# EAGLE design bac-bmb (EAGLE 6.6.0)
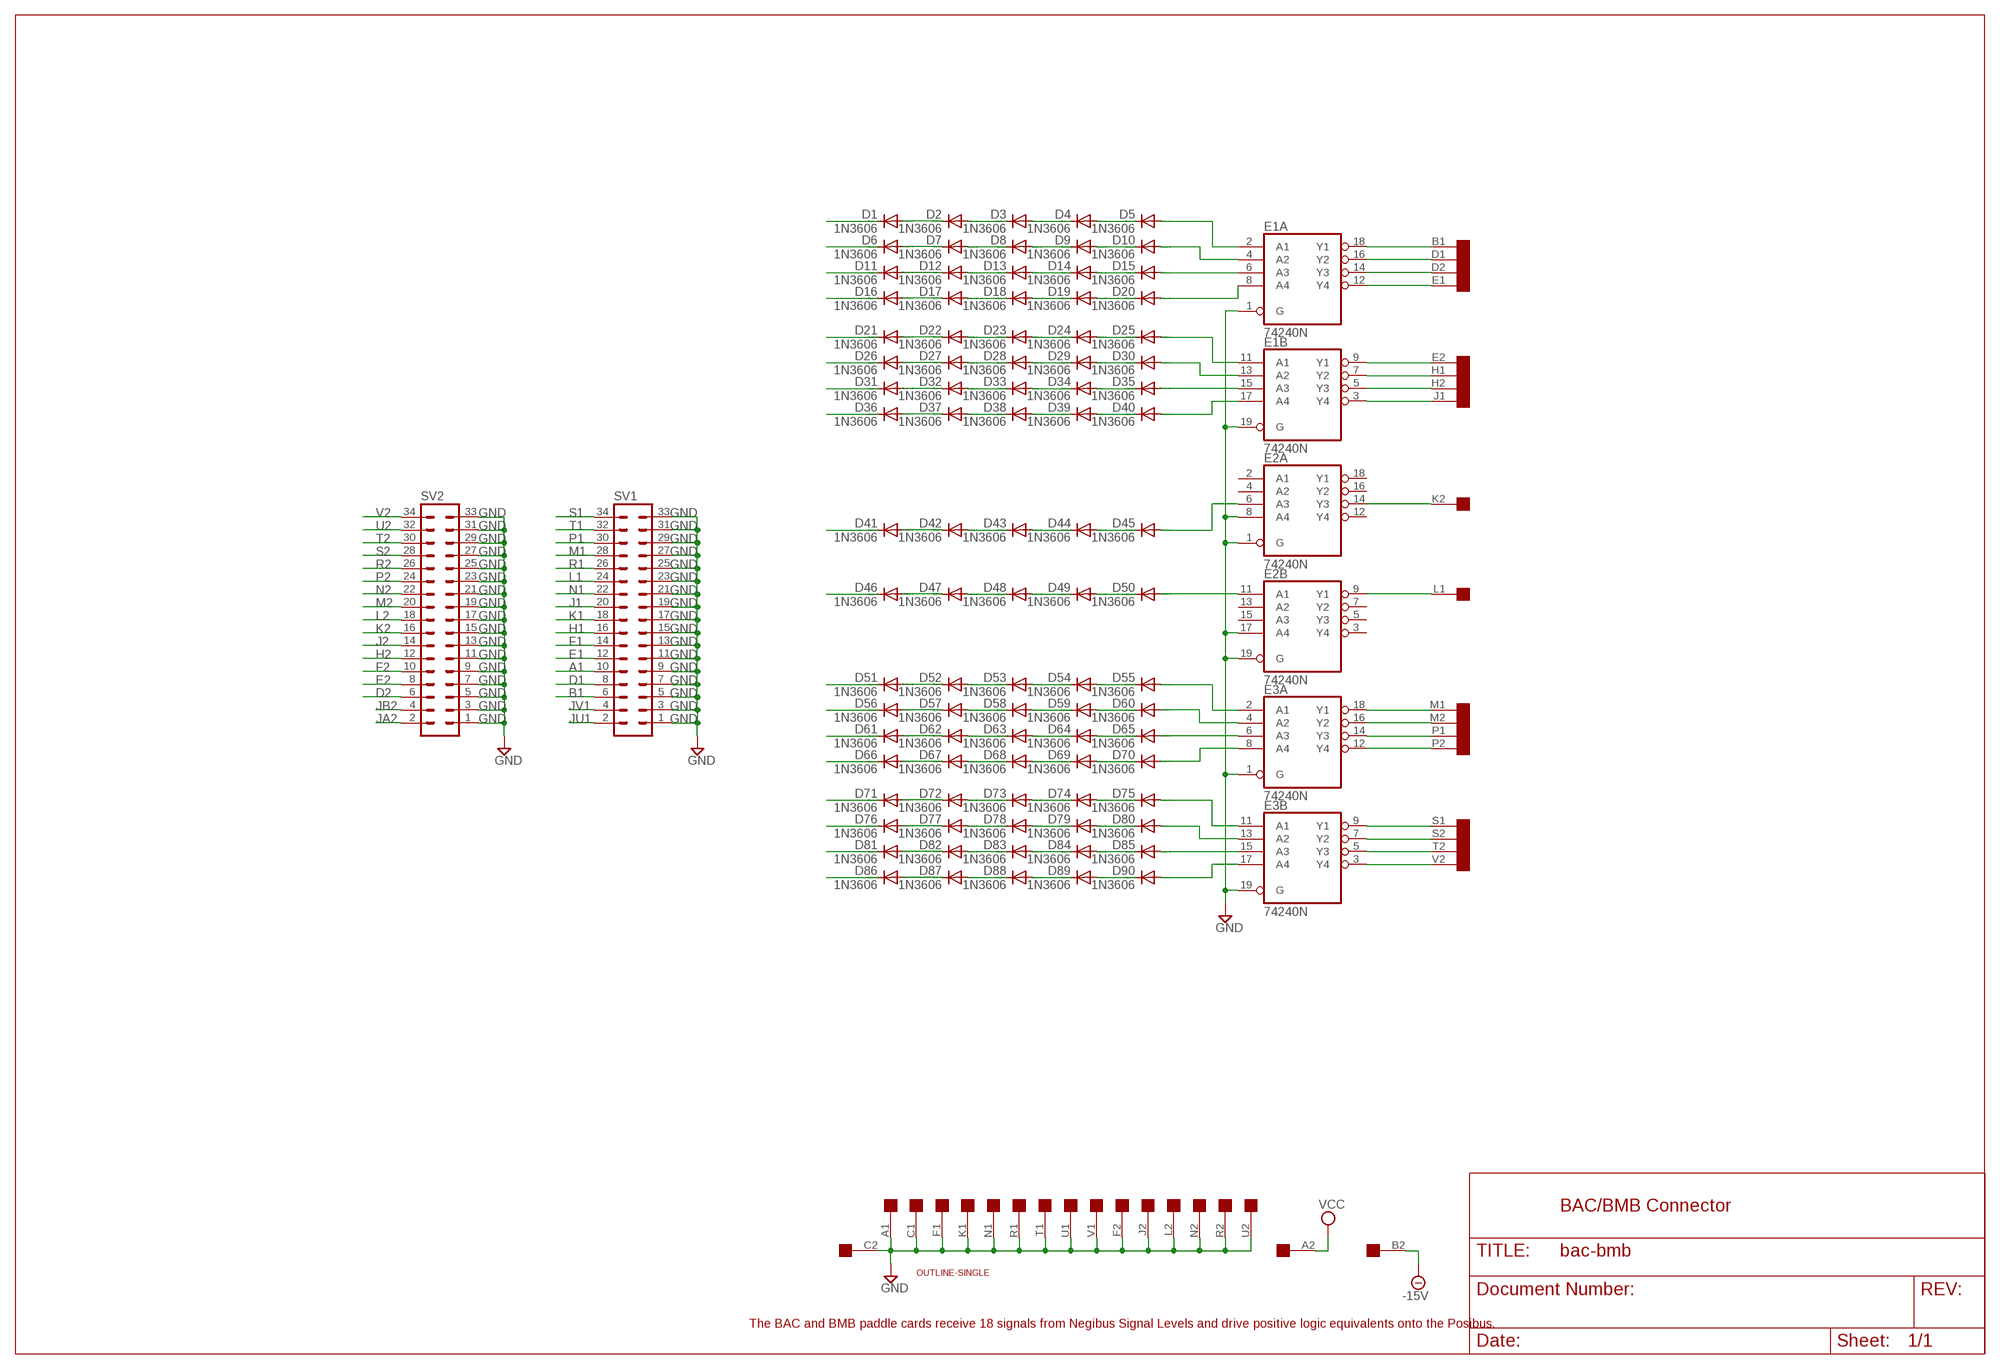
[diagram p0: schematic, sheet 1]

## Parts
D1  1N3606  DIODE-DO35-10  [DO35-10]
D2  1N3606  DIODE-DO35-10  [DO35-10]
D3  1N3606  DIODE-DO35-10  [DO35-10]
D4  1N3606  DIODE-DO35-10  [DO35-10]
D5  1N3606  DIODE-DO35-10  [DO35-10]
D6  1N3606  DIODE-DO35-10  [DO35-10]
D7  1N3606  DIODE-DO35-10  [DO35-10]
D8  1N3606  DIODE-DO35-10  [DO35-10]
D9  1N3606  DIODE-DO35-10  [DO35-10]
D10  1N3606  DIODE-DO35-10  [DO35-10]
D11  1N3606  DIODE-DO35-10  [DO35-10]
D12  1N3606  DIODE-DO35-10  [DO35-10]
D13  1N3606  DIODE-DO35-10  [DO35-10]
D14  1N3606  DIODE-DO35-10  [DO35-10]
D15  1N3606  DIODE-DO35-10  [DO35-10]
D16  1N3606  DIODE-DO35-10  [DO35-10]
D17  1N3606  DIODE-DO35-10  [DO35-10]
D18  1N3606  DIODE-DO35-10  [DO35-10]
D19  1N3606  DIODE-DO35-10  [DO35-10]
D20  1N3606  DIODE-DO35-10  [DO35-10]
D21  1N3606  DIODE-DO35-10  [DO35-10]
D22  1N3606  DIODE-DO35-10  [DO35-10]
D23  1N3606  DIODE-DO35-10  [DO35-10]
D24  1N3606  DIODE-DO35-10  [DO35-10]
D25  1N3606  DIODE-DO35-10  [DO35-10]
D26  1N3606  DIODE-DO35-10  [DO35-10]
D27  1N3606  DIODE-DO35-10  [DO35-10]
D28  1N3606  DIODE-DO35-10  [DO35-10]
D29  1N3606  DIODE-DO35-10  [DO35-10]
D30  1N3606  DIODE-DO35-10  [DO35-10]
D31  1N3606  DIODE-DO35-10  [DO35-10]
D32  1N3606  DIODE-DO35-10  [DO35-10]
D33  1N3606  DIODE-DO35-10  [DO35-10]
D34  1N3606  DIODE-DO35-10  [DO35-10]
D35  1N3606  DIODE-DO35-10  [DO35-10]
D36  1N3606  DIODE-DO35-10  [DO35-10]
D37  1N3606  DIODE-DO35-10  [DO35-10]
D38  1N3606  DIODE-DO35-10  [DO35-10]
D39  1N3606  DIODE-DO35-10  [DO35-10]
D40  1N3606  DIODE-DO35-10  [DO35-10]
D41  1N3606  DIODE-DO35-10  [DO35-10]
D42  1N3606  DIODE-DO35-10  [DO35-10]
D43  1N3606  DIODE-DO35-10  [DO35-10]
D44  1N3606  DIODE-DO35-10  [DO35-10]
D45  1N3606  DIODE-DO35-10  [DO35-10]
D46  1N3606  DIODE-DO35-10  [DO35-10]
D47  1N3606  DIODE-DO35-10  [DO35-10]
D48  1N3606  DIODE-DO35-10  [DO35-10]
D49  1N3606  DIODE-DO35-10  [DO35-10]
D50  1N3606  DIODE-DO35-10  [DO35-10]
D51  1N3606  DIODE-DO35-10  [DO35-10]
D52  1N3606  DIODE-DO35-10  [DO35-10]
D53  1N3606  DIODE-DO35-10  [DO35-10]
D54  1N3606  DIODE-DO35-10  [DO35-10]
D55  1N3606  DIODE-DO35-10  [DO35-10]
D56  1N3606  DIODE-DO35-10  [DO35-10]
D57  1N3606  DIODE-DO35-10  [DO35-10]
D58  1N3606  DIODE-DO35-10  [DO35-10]
D59  1N3606  DIODE-DO35-10  [DO35-10]
D60  1N3606  DIODE-DO35-10  [DO35-10]
D61  1N3606  DIODE-DO35-10  [DO35-10]
D62  1N3606  DIODE-DO35-10  [DO35-10]
D63  1N3606  DIODE-DO35-10  [DO35-10]
D64  1N3606  DIODE-DO35-10  [DO35-10]
D65  1N3606  DIODE-DO35-10  [DO35-10]
D66  1N3606  DIODE-DO35-10  [DO35-10]
D67  1N3606  DIODE-DO35-10  [DO35-10]
D68  1N3606  DIODE-DO35-10  [DO35-10]
D69  1N3606  DIODE-DO35-10  [DO35-10]
D70  1N3606  DIODE-DO35-10  [DO35-10]
D71  1N3606  DIODE-DO35-10  [DO35-10]
D72  1N3606  DIODE-DO35-10  [DO35-10]
D73  1N3606  DIODE-DO35-10  [DO35-10]
D74  1N3606  DIODE-DO35-10  [DO35-10]
D75  1N3606  DIODE-DO35-10  [DO35-10]
D76  1N3606  DIODE-DO35-10  [DO35-10]
D77  1N3606  DIODE-DO35-10  [DO35-10]
D78  1N3606  DIODE-DO35-10  [DO35-10]
D79  1N3606  DIODE-DO35-10  [DO35-10]
D80  1N3606  DIODE-DO35-10  [DO35-10]
D81  1N3606  DIODE-DO35-10  [DO35-10]
D82  1N3606  DIODE-DO35-10  [DO35-10]
D83  1N3606  DIODE-DO35-10  [DO35-10]
D84  1N3606  DIODE-DO35-10  [DO35-10]
D85  1N3606  DIODE-DO35-10  [DO35-10]
D86  1N3606  DIODE-DO35-10  [DO35-10]
D87  1N3606  DIODE-DO35-10  [DO35-10]
D88  1N3606  DIODE-DO35-10  [DO35-10]
D89  1N3606  DIODE-DO35-10  [DO35-10]
D90  1N3606  DIODE-DO35-10  [DO35-10]
E1  74240N  74LS240N  [DIL20]
E2  74240N  74LS240N  [DIL20]
E3  74240N  74LS240N  [DIL20]
SV1  MA17-2  [MA17-2]
SV2  MA17-2  [MA17-2]
U$1  SINGLE  [EDGE-CON2]
U$2  OUTLINE-SINGLE  [SINGLE]

## Nets
-15V: U$1.B2
A1: SV1.10
B1: D1.C SV1.6
D1: D6.C SV1.8
D2: D11.C SV2.6
E1: D16.C SV1.12
E2: D21.C SV2.8
F1: SV1.14
F2: SV2.10
GND [power]: E1.1(A:G) E1.19(B:G) E2.1(A:G) E2.8(A:A4) E2.17(B:A4) E2.19(B:G) E3.1(A:G) E3.19(B:G) SV1.1 SV1.3 SV1.5 SV1.7 SV1.9 SV1.11 SV1.13 SV1.15 SV1.17 SV1.19 SV1.21 SV1.23 SV1.25 SV1.27 SV1.29 SV1.31 SV1.33 SV2.1 SV2.3 SV2.5 SV2.7 SV2.9 SV2.11 SV2.13 SV2.15 SV2.17 SV2.19 SV2.21 SV2.23 SV2.25 SV2.27 SV2.29 SV2.31 SV2.33 U$1.A1 U$1.C1 U$1.C2 U$1.F1 U$1.F2 U$1.J2 U$1.K1 U$1.L2 U$1.N1 U$1.N2 U$1.R1 U$1.R2 U$1.T1 U$1.U1 U$1.U2 U$1.V1
H1: D26.C SV1.16
H2: D31.C SV2.12
J1: D36.C SV1.20
J2: SV2.14
JA2: SV2.2
JB2: SV2.4
JU1: SV1.2
JV1: SV1.4
K1: SV1.18
K2: D41.C SV2.16
L1: D46.C SV1.24
L2: SV2.18
M1: D51.C SV1.28
M2: D56.C SV2.20
N1: SV1.22
N2: SV2.22
N$1: D1.A D2.C
N$2: D2.A D3.C
N$3: D3.A D4.C
N$4: D4.A D5.C
N$5: D6.A D7.C
N$6: D7.A D8.C
N$7: D8.A D9.C
N$8: D9.A D10.C
N$9: D11.A D12.C
N$10: D12.A D13.C
N$11: D13.A D14.C
N$12: D14.A D15.C
N$13: D16.A D17.C
N$14: D17.A D18.C
N$15: D18.A D19.C
N$16: D19.A D20.C
N$17: D21.A D22.C
N$18: D22.A D23.C
N$19: D23.A D24.C
N$20: D24.A D25.C
N$21: D26.A D27.C
N$22: D27.A D28.C
N$23: D28.A D29.C
N$24: D29.A D30.C
N$25: D31.A D32.C
N$26: D32.A D33.C
N$27: D33.A D34.C
N$28: D34.A D35.C
N$29: D36.A D37.C
N$30: D37.A D38.C
N$31: D38.A D39.C
N$32: D39.A D40.C
N$33: D41.A D42.C
N$34: D42.A D43.C
N$35: D43.A D44.C
N$36: D44.A D45.C
N$37: D46.A D47.C
N$38: D47.A D48.C
N$39: D48.A D49.C
N$40: D49.A D50.C
N$41: D51.A D52.C
N$42: D52.A D53.C
N$43: D53.A D54.C
N$44: D54.A D55.C
N$45: D56.A D57.C
N$46: D57.A D58.C
N$47: D58.A D59.C
N$48: D59.A D60.C
N$49: D61.A D62.C
N$50: D62.A D63.C
N$51: D63.A D64.C
N$52: D64.A D65.C
N$53: D66.A D67.C
N$54: D67.A D68.C
N$55: D68.A D69.C
N$56: D69.A D70.C
N$57: D71.A D72.C
N$58: D72.A D73.C
N$59: D73.A D74.C
N$60: D74.A D75.C
N$61: D76.A D77.C
N$62: D77.A D78.C
N$63: D78.A D79.C
N$64: D79.A D80.C
N$65: D81.A D82.C
N$66: D82.A D83.C
N$67: D83.A D84.C
N$68: D84.A D85.C
N$69: D86.A D87.C
N$70: D87.A D88.C
N$71: D88.A D89.C
N$72: D89.A D90.C
N$73: D10.A E1.4(A:A2)
N$74: D85.A E3.15(B:A3)
N$75: D5.A E1.2(A:A1)
N$76: D15.A E1.6(A:A3)
N$77: D20.A E1.8(A:A4)
N$78: D25.A E1.11(B:A1)
N$79: D30.A E1.13(B:A2)
N$80: D35.A E1.15(B:A3)
N$81: D40.A E1.17(B:A4)
N$82: D45.A E2.6(A:A3)
N$83: D50.A E2.11(B:A1)
N$84: D55.A E3.2(A:A1)
N$85: D60.A E3.4(A:A2)
N$86: D65.A E3.6(A:A3)
N$87: D70.A E3.8(A:A4)
N$88: D75.A E3.11(B:A1)
N$89: D80.A E3.13(B:A2)
N$90: D90.A E3.17(B:A4)
N$91: E3.5(B:Y3) U$1.T2
N$92: E1.18(A:Y1) U$1.B1
N$93: E1.16(A:Y2) U$1.D1
N$94: E1.14(A:Y3) U$1.D2
N$95: E1.12(A:Y4) U$1.E1
N$96: E1.9(B:Y1) U$1.E2
N$97: E1.7(B:Y2) U$1.H1
N$98: E1.5(B:Y3) U$1.H2
N$99: E1.3(B:Y4) U$1.J1
N$100: E2.14(A:Y3) U$1.K2
N$101: E2.9(B:Y1) U$1.L1
N$102: E3.18(A:Y1) U$1.M1
N$103: E3.16(A:Y2) U$1.M2
N$104: E3.14(A:Y3) U$1.P1
N$105: E3.12(A:Y4) U$1.P2
N$106: E3.9(B:Y1) U$1.S1
N$107: E3.7(B:Y2) U$1.S2
N$108: E3.3(B:Y4) U$1.V2
P1: D61.C SV1.30
P2: D66.C SV2.24
R1: SV1.26
R2: SV2.26
S1: D71.C SV1.34
S2: D76.C SV2.28
T1: SV1.32
T2: D81.C SV2.30
U2: SV2.32
V2: D86.C SV2.34
VCC [power]: U$1.A2
Unconnected: E2.2(A:A1) E2.3(B:Y4) E2.4(A:A2) E2.5(B:Y3) E2.7(B:Y2) E2.12(A:Y4) E2.13(B:A2) E2.15(B:A3) E2.16(A:Y2) E2.18(A:Y1)

## Notes on the sheet
- BAC/BMB Connector
- The BAC and BMB paddle cards receive 18 signals from Negibus Signal Levels and drive positive logic equivalents onto the Posibus.

## Power pins joined to a net without a drawn wire
GND: E1.10(P:GND) E2.10(P:GND) E3.10(P:GND)
VCC: E1.20(P:VCC) E2.20(P:VCC) E3.20(P:VCC)

## Library data of the parts
D1-D90 = diode:DIODE-: DIODE
E1-E3 = 74xx-us:74*240: Octal BUFFER and LINE DRIVER, 3-state
SV1 SV2 = con-lstb:MA17-2: PIN HEADER; OC_FARNELL: unknown; OC_NEWARK: unknown
U$1 = dec-con:SINGLE: Single-Height DEC board
U$2 = dec-con:OUTLINE-*: Board outlines for DEC boards.

## Net classes
1 power: width 0.813 mm

## Board
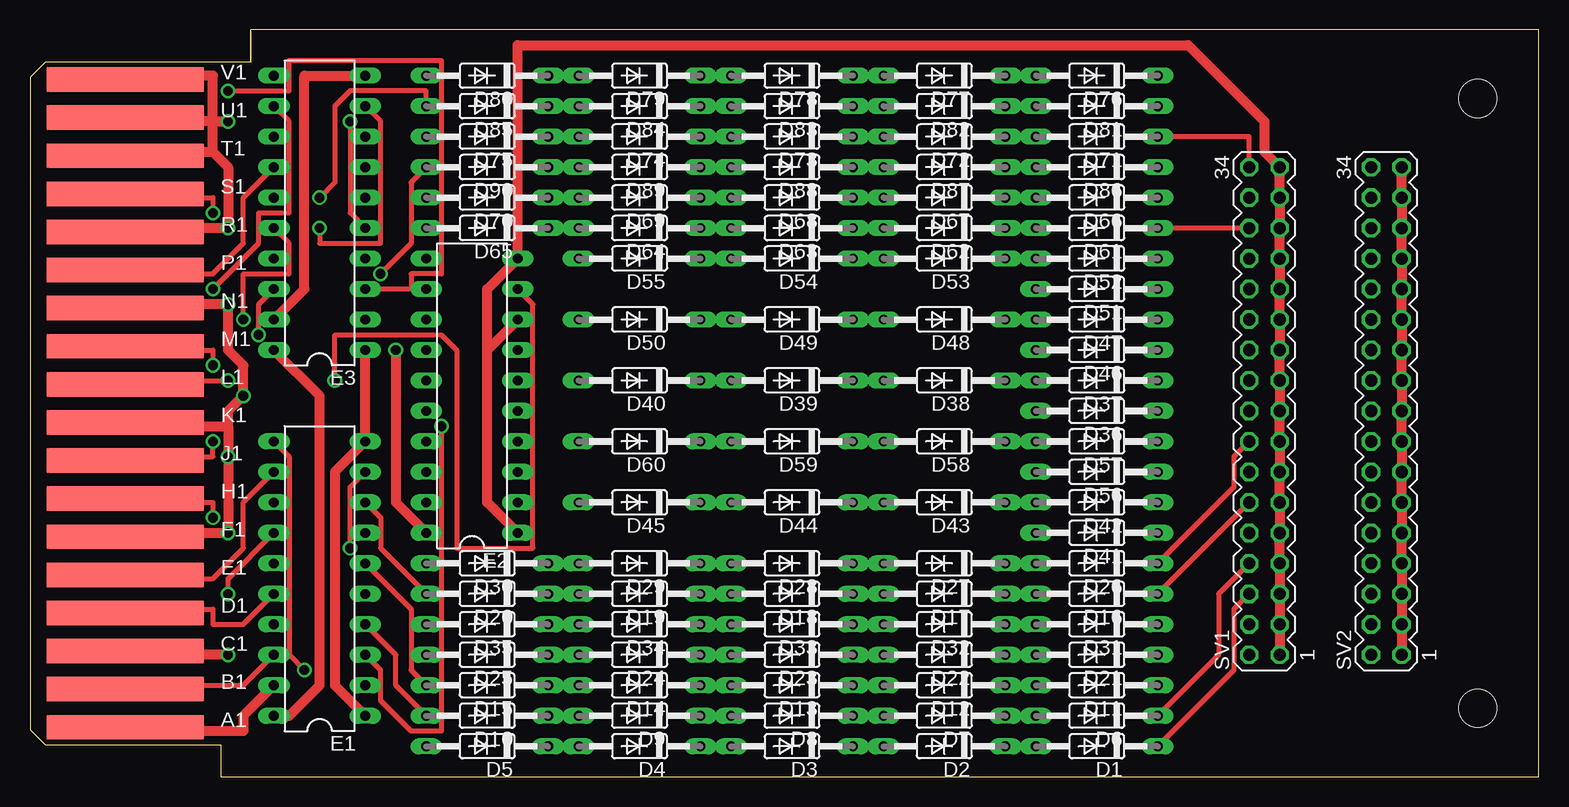
[diagram p1: board, top side]
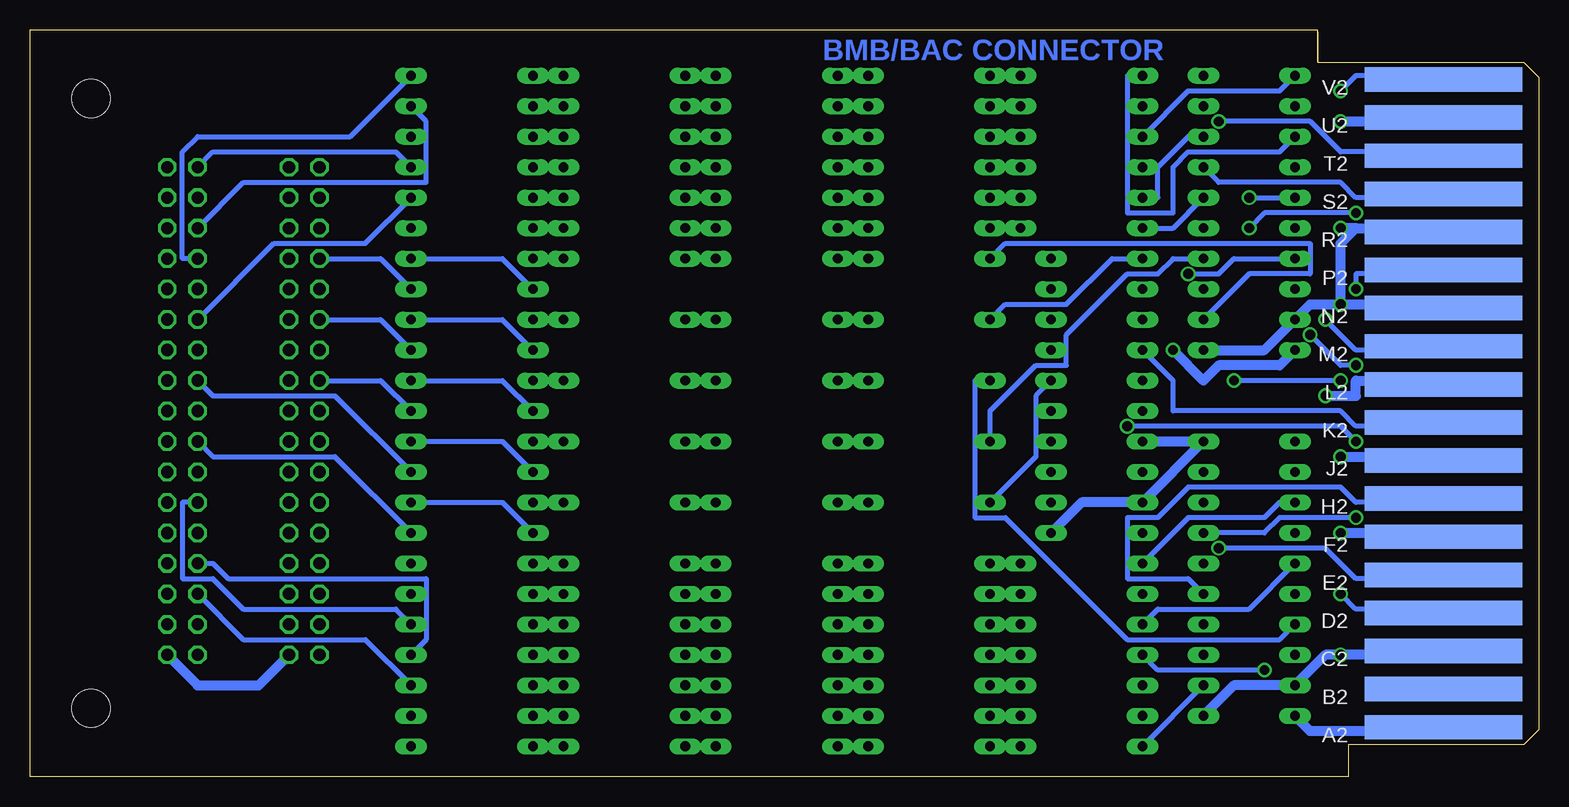
[diagram p2: board, bottom side, seen from below]

Size 125.73 x 62.23 mm. Coordinates in mm from the lower left corner, seen from the top.
Copper layers (1+16): Top 0.035mm / dielectric 1.5mm / Bottom 0.035mm
Design rules "16mils": minimum track width 16mil, minimum drill 32mil, track to track 15mil, track to pad 10mil, pad to pad 10mil, via to via 10mil, smd to smd 10mil, copper to edge 13mil, drill to drill 10mil, minimum pad ring 10mil, minimum via ring 8mil, stop-mask expansion 0mil, vias tented up to drill 0mil, thermal gap 10mil

### Footprints (pad centres in the part's own frame; a part is rotated, then mirrored left to right if it is on the bottom)
DO35-10 = drill 0.813 long: A 5.08,0; C -5.08,0
DIL20 = drill 0.813 long: 1 -11.43,-3.81; 2 -8.89,-3.81; 3 -6.35,-3.81; 4 -3.81,-3.81; 5 -1.27,-3.81; 6 1.27,-3.81; 7 3.81,-3.81; 8 6.35,-3.81; 9 8.89,-3.81; 10 11.43,-3.81; 11 11.43,3.81; 12 8.89,3.81; 13 6.35,3.81; 14 3.81,3.81; 15 1.27,3.81; 16 -1.27,3.81; 17 -3.81,3.81; 18 -6.35,3.81; 19 -8.89,3.81; 20 -11.43,3.81
MA17-2 = drill 1.016 octagon: 1 -20.32,-1.27; 2 -20.32,1.27; 3 -17.78,-1.27; 4 -17.78,1.27; 5 -15.24,-1.27; 6 -15.24,1.27; 7 -12.7,-1.27; 8 -12.7,1.27; 9 -10.16,-1.27; 10 -10.16,1.27; 11 -7.62,-1.27; 12 -7.62,1.27; 13 -5.08,-1.27; 14 -5.08,1.27; 15 -2.54,-1.27; 16 -2.54,1.27; 17 0,-1.27; 18 0,1.27; 19 2.54,-1.27; 20 2.54,1.27; 21 5.08,-1.27; 22 5.08,1.27; 23 7.62,-1.27; 24 7.62,1.27; 25 10.16,-1.27; 26 10.16,1.27; 27 12.7,-1.27; 28 12.7,1.27; 29 15.24,-1.27; 30 15.24,1.27; 31 17.78,-1.27; 32 17.78,1.27; 33 20.32,-1.27; 34 20.32,1.27
EDGE-CON2 = smd 13.106 x 2.032: A1 7.938,4.128; B1 7.938,7.303; C1 7.938,10.477; D1 7.938,13.652; E1 7.938,16.828; F1 7.938,20.003; H1 7.938,23.177; J1 7.938,26.352; K1 7.938,29.527; L1 7.938,32.703; M1 7.938,35.877; N1 7.938,39.053; P1 7.938,42.227; R1 7.938,45.403; S1 7.938,48.578; T1 7.938,51.752; U1 7.938,54.928; V1 7.938,58.102 | smd 13.106 x 2.032 bottom: A2 7.938,4.128; B2 7.938,7.303; C2 7.938,10.477; D2 7.938,13.652; E2 7.938,16.828; F2 7.938,20.003; H2 7.938,23.177; J2 7.938,26.352; K2 7.938,29.527; L2 7.938,32.703; M2 7.938,35.877; N2 7.938,39.053; P2 7.938,42.227; R2 7.938,45.403; S2 7.938,48.578; T2 7.938,51.752; U2 7.938,54.928; V2 7.938,58.102
SINGLE = hole 3.175: 120.65,56.515; 120.65,5.715

### Placement (x,y rotation side)
D1  88.9,2.54 180 top
D2  76.2,2.54 180 top
D3  63.5,2.54 180 top
D4  50.8,2.54 180 top
D5  38.1,2.54 180 top
D6  88.9,5.08 180 top
D7  76.2,5.08 180 top
D8  63.5,5.08 180 top
D9  50.8,5.08 180 top
D10  38.1,5.08 180 top
D11  88.9,7.62 180 top
D12  76.2,7.62 180 top
D13  63.5,7.62 180 top
D14  50.8,7.62 180 top
D15  38.1,7.62 180 top
D16  88.9,15.24 180 top
D17  76.2,15.24 180 top
D18  63.5,15.24 180 top
D19  50.8,15.24 180 top
D20  38.1,15.24 180 top
D21  88.9,10.16 180 top
D22  76.2,10.16 180 top
D23  63.5,10.16 180 top
D24  50.8,10.16 180 top
D25  38.1,10.16 180 top
D26  88.9,17.78 180 top
D27  76.2,17.78 180 top
D28  63.5,17.78 180 top
D29  50.8,17.78 180 top
D30  38.1,17.78 180 top
D31  88.9,12.7 180 top
D32  76.2,12.7 180 top
D33  63.5,12.7 180 top
D34  50.8,12.7 180 top
D35  38.1,12.7 180 top
D36  88.9,30.48 180 top
D37  88.9,33.02 180 top
D38  76.2,33.02 180 top
D39  63.5,33.02 180 top
D40  50.8,33.02 180 top
D41  88.9,20.32 180 top
D42  88.9,22.86 180 top
D43  76.2,22.86 180 top
D44  63.5,22.86 180 top
D45  50.8,22.86 180 top
D46  88.9,35.56 180 top
D47  88.9,38.1 180 top
D48  76.2,38.1 180 top
D49  63.5,38.1 180 top
D50  50.8,38.1 180 top
D51  88.9,40.64 180 top
D52  88.9,43.18 180 top
D53  76.2,43.18 180 top
D54  63.5,43.18 180 top
D55  50.8,43.18 180 top
D56  88.9,25.4 180 top
D57  88.9,27.94 180 top
D58  76.2,27.94 180 top
D59  63.5,27.94 180 top
D60  50.8,27.94 180 top
D61  88.9,45.72 180 top
D62  76.2,45.72 180 top
D63  63.5,45.72 180 top
D64  50.8,45.72 180 top
D65  38.1,45.72 180 top
D66  88.9,48.26 180 top
D67  76.2,48.26 180 top
D68  63.5,48.26 180 top
D69  50.8,48.26 180 top
D70  38.1,48.26 180 top
D71  88.9,53.34 180 top
D72  76.2,53.34 180 top
D73  63.5,53.34 180 top
D74  50.8,53.34 180 top
D75  38.1,53.34 180 top
D76  88.9,58.42 180 top
D77  76.2,58.42 180 top
D78  63.5,58.42 180 top
D79  50.8,58.42 180 top
D80  38.1,58.42 180 top
D81  88.9,55.88 180 top
D82  76.2,55.88 180 top
D83  63.5,55.88 180 top
D84  50.8,55.88 180 top
D85  38.1,55.88 180 top
D86  88.9,50.8 180 top
D87  76.2,50.8 180 top
D88  63.5,50.8 180 top
D89  50.8,50.8 180 top
D90  38.1,50.8 180 top
E1  24.13,16.51 90 top
E2  36.83,31.75 90 top
E3  24.13,46.99 90 top
SV1  102.87,30.48 90 top
SV2  113.03,30.48 90 top
U$1  0,0 0 top
U$2  0,0 0 top

### Tracks (layer width: path | path; a pad name or v marks a point on that pad's centre or on a via)
B1
  Top 0.406: D1.C 100.33,8.89 100.33,13.97 SV1.6
D1
  Top 0.406: D6.C 99.06,10.16 99.06,15.24 SV1.8
D2
  Bottom 0.406: D11.C 97.79,11.43 107.95,11.43 SV2.6
E1
  Top 0.406: SV1.12 D16.C
E2
  Bottom 0.406: D21.C 92.71,11.43 92.71,16.51 109.22,16.51 110.49,17.78 SV2.8
GND  (via drill 0.81)
  Top 0.813: SV1.1 SV1.3 SV1.5 SV1.7 SV1.9 SV1.11 SV1.13 SV1.15 SV1.17 SV1.19 SV1.21 SV1.23 SV1.25 SV1.27 SV1.29 SV1.31 SV1.33 102.87,52.07 102.87,54.61 96.52,60.96 40.64,60.96 E2.10 38.1,40.64 38.1,35.56 | SV2.33 SV2.31 SV2.29 SV2.27 SV2.25 SV2.23 SV2.21 SV2.19 SV2.17 SV2.15 SV2.13 SV2.11 SV2.9 SV2.7 SV2.5 SV2.3 SV2.1 | U$1.F2 8.89,20.32 v16.51,20.32 v16.51,26.67 16.51,29.21 | 16.51,29.21 8.89,29.21 U$1.K1 | 16.51,29.21 16.51,30.48 v17.78,31.75 17.78,34.29 16.51,35.56 v16.51,39.37 8.89,39.37 U$1.N2 | E1.19 17.78,5.08 17.78,3.81 8.89,3.81 U$1.A1 | v16.51,10.16 8.89,10.16 U$1.C2 | 15.24,52.07 16.51,50.8 v16.51,45.72 8.89,45.72 U$1.R2 | 15.24,52.07 8.89,52.07 U$1.T1 | 15.24,54.61 8.89,54.61 U$1.U1 | 15.24,52.07 15.24,54.61 | 15.24,54.61 v16.51,54.61 | 15.24,54.61 15.24,58.42 8.89,58.42 U$1.V1 | E3.1 E1.10 25.4,25.4 25.4,7.62 E1.1 | 38.1,35.56 E2.8 | 38.1,35.56 38.1,22.86 E2.1 | E3.10 22.86,58.42 22.86,40.64 E3.19
  Bottom 0.813: SV1.1 106.68,7.62 111.76,7.62 SV2.1 | v16.51,20.32 8.89,20.32 U$1.F2 | v16.51,26.67 8.89,26.67 U$1.J2 | v17.78,31.75 15.24,31.75 15.24,33.02 8.89,33.02 U$1.L2 | E1.1 25.4,7.62 E1.19 17.78,10.16 v16.51,10.16 8.89,10.16 U$1.C2 | v16.51,54.61 8.89,54.61 U$1.U1 | E2.17 E1.10 E2.19 38.1,22.86 E2.1 | E3.1 22.86,35.56 E3.19 19.05,39.37 v16.51,39.37 | v16.51,39.37 8.89,39.37 U$1.N2 | 15.24,45.72 8.89,45.72 U$1.R2 | 15.24,45.72 16.51,44.45 v16.51,39.37 | 15.24,45.72 v16.51,45.72
H1
  Top 0.406: D26.C 100.33,24.13 100.33,26.67 SV1.16
H2
  Bottom 0.406: D31.C 95.25,13.97 107.95,13.97 110.49,16.51 113.03,16.51 113.03,22.86 SV2.12
J1
  Bottom 0.406: D36.C 96.52,33.02 SV1.20
K2
  Bottom 0.406: D41.C 100.33,26.67 110.49,26.67 SV2.16
L1
  Bottom 0.406: D46.C 96.52,38.1 SV1.24
M1
  Bottom 0.406: D51.C 96.52,43.18 SV1.28
M2
  Bottom 0.406: D56.C 100.33,31.75 110.49,31.75 SV2.20
N$1
  Top 0.406: D1.A D2.C
N$2
  Top 0.406: D2.A D3.C
N$3
  Top 0.406: D3.A D4.C
N$4
  Top 0.406: D4.A D5.C
N$5
  Top 0.406: D6.A D7.C
N$6
  Top 0.406: D7.A D8.C
N$7
  Top 0.406: D8.A D9.C
N$8
  Top 0.406: D9.A D10.C
N$9
  Top 0.406: D11.A D12.C
N$10
  Top 0.406: D12.A D13.C
N$11
  Top 0.406: D13.A D14.C
N$12
  Top 0.406: D14.A D15.C
N$13
  Top 0.406: D16.A D17.C
N$14
  Top 0.406: D17.A D18.C
N$15
  Top 0.406: D18.A D19.C
N$16
  Top 0.406: D19.A D20.C
N$17
  Top 0.406: D21.A D22.C
N$18
  Top 0.406: D22.A D23.C
N$19
  Top 0.406: D23.A D24.C
N$20
  Top 0.406: D24.A D25.C
N$21
  Top 0.406: D26.A D27.C
N$22
  Top 0.406: D27.A D28.C
N$23
  Top 0.406: D28.A D29.C
N$24
  Top 0.406: D29.A D30.C
N$25
  Top 0.406: D31.A D32.C
N$26
  Top 0.406: D32.A D33.C
N$27
  Top 0.406: D33.A D34.C
N$28
  Top 0.406: D34.A D35.C
N$29
  Bottom 0.406: D36.A 86.36,33.02 D37.C
N$30
  Top 0.406: D37.A D38.C
N$31
  Top 0.406: D38.A D39.C
N$32
  Top 0.406: D39.A D40.C
N$33
  Bottom 0.406: D41.A 86.36,22.86 D42.C
N$34
  Top 0.406: D42.A D43.C
N$35
  Top 0.406: D43.A D44.C
N$36
  Top 0.406: D44.A D45.C
N$37
  Bottom 0.406: D46.A 86.36,38.1 D47.C
N$38
  Top 0.406: D47.A D48.C
N$39
  Top 0.406: D48.A D49.C
N$40
  Top 0.406: D49.A D50.C
N$41
  Bottom 0.406: D51.A 86.36,43.18 D52.C
N$42
  Top 0.406: D52.A D53.C
N$43
  Top 0.406: D53.A D54.C
N$44
  Top 0.406: D54.A D55.C
N$45
  Bottom 0.406: D56.A 86.36,27.94 D57.C
N$46
  Top 0.406: D57.A D58.C
N$47
  Top 0.406: D58.A D59.C
N$48
  Top 0.406: D59.A D60.C
N$49
  Top 0.406: D61.A D62.C
N$50
  Top 0.406: D62.A D63.C
N$51
  Top 0.406: D63.A D64.C
N$52
  Top 0.406: D64.A D65.C
N$53
  Top 0.406: D66.A D67.C
N$54
  Top 0.406: D67.A D68.C
N$55
  Top 0.406: D68.A D69.C
N$56
  Top 0.406: D69.A D70.C
N$57
  Top 0.406: D71.A D72.C
N$58
  Top 0.406: D72.A D73.C
N$59
  Top 0.406: D73.A D74.C
N$60
  Top 0.406: D74.A D75.C
N$61
  Top 0.406: D76.A D77.C
N$62
  Top 0.406: D77.A D78.C
N$63
  Top 0.406: D78.A D79.C
N$64
  Top 0.406: D79.A D80.C
N$65
  Top 0.406: D81.A D82.C
N$66
  Top 0.406: D82.A D83.C
N$67
  Top 0.406: D83.A D84.C
N$68
  Top 0.406: D84.A D85.C
N$69
  Top 0.406: D86.A D87.C
N$70
  Top 0.406: D87.A D88.C
N$71
  Top 0.406: D88.A D89.C
N$72
  Top 0.406: D89.A D90.C
N$73
  Top 0.406: E1.4 30.48,10.16 30.48,7.62 D10.A
N$74  (via drill 0.81)
  Top 0.406: v24.13,48.26 25.4,49.53 25.4,55.88 26.67,57.15 33.02,57.15 D85.A
  Bottom 0.406: v24.13,48.26 E3.15
N$75
  Bottom 0.406: D5.A E1.2
N$76
  Top 0.406: D15.A 31.75,8.89 31.75,13.97 E1.6
N$77
  Top 0.406: D20.A 29.21,19.05 29.21,21.59 E1.8
N$78  (via drill 0.81)
  Top 0.406: v22.86,8.89 21.59,10.16 21.59,26.67 E1.11
  Bottom 0.406: D25.A 31.75,8.89 v22.86,8.89
N$79
  Bottom 0.406: D30.A 29.21,21.59 22.86,21.59 21.59,22.86 E1.13
N$80
  Bottom 0.406: E1.15 24.13,13.97 31.75,13.97 D35.A
N$81
  Bottom 0.406: E1.17 21.59,11.43 34.29,11.43 44.45,21.59 46.99,21.59 46.99,33.02 D40.A
N$82
  Bottom 0.406: D45.A 41.91,26.67 41.91,31.75 E2.6
N$83
  Bottom 0.406: E2.11 35.56,43.18 39.37,39.37 44.45,39.37 D50.A
N$84
  Bottom 0.406: E3.2 24.13,41.91 19.05,41.91 19.05,44.45 44.45,44.45 D55.A
N$85
  Bottom 0.406: E3.4 30.48,43.18 31.75,41.91 34.29,41.91 39.37,36.83 39.37,34.29 41.91,34.29 45.72,30.48 D60.A
N$86
  Bottom 0.406: E3.6 30.48,45.72 D65.A
N$87
  Bottom 0.406: E3.8 29.21,53.34 31.75,50.8 31.75,48.26 D70.A
N$88
  Bottom 0.406: E3.11 21.59,57.15 29.21,57.15 D75.A
N$89
  Bottom 0.406: E3.13 21.59,52.07 29.21,52.07 30.48,50.8 30.48,46.99 34.29,46.99 34.29,58.42 D80.A
N$90  (via drill 0.81)
  Top 0.406: v29.21,41.91 31.75,44.45 31.75,49.53 D90.A
  Bottom 0.406: E3.17 25.4,43.18 26.67,41.91 v29.21,41.91
N$91  (via drill 0.81)
  Top 0.406: E3.5 26.67,46.99 v26.67,54.61
  Bottom 0.406: v26.67,54.61 19.05,54.61 16.51,52.07 8.89,52.07 U$1.T2
N$92
  Top 0.406: E1.18 17.78,7.62 8.89,7.62 U$1.B1
N$93
  Top 0.406: E1.16 17.78,12.7 15.24,12.7 15.24,13.97 8.89,13.97 U$1.D1
N$94  (via drill 0.81)
  Top 0.406: E1.14 16.51,16.51 v16.51,15.24
  Bottom 0.406: v16.51,15.24 15.24,13.97 8.89,13.97 U$1.D2
N$95
  Top 0.406: E1.12 17.78,22.86 17.78,19.05 15.24,16.51 8.89,16.51 U$1.E1
N$96  (via drill 0.81)
  Top 0.406: E1.9 26.67,24.13 v26.67,19.05
  Bottom 0.406: v26.67,19.05 17.78,19.05 15.24,16.51 8.89,16.51 U$1.E2
N$97  (via drill 0.81)
  Top 0.406: v15.24,21.59 15.24,22.86 8.89,22.86 U$1.H1
  Bottom 0.406: E1.7 22.86,20.32 21.59,21.59 v15.24,21.59
N$98
  Bottom 0.406: E1.5 29.21,16.51 34.29,16.51 34.29,21.59 31.75,21.59 29.21,24.13 16.51,24.13 15.24,22.86 8.89,22.86 U$1.H2
N$99  (via drill 0.81)
  Top 0.406: E1.3 29.21,8.89 29.21,6.35 31.75,3.81 34.29,3.81 v34.29,29.21 | v15.24,27.94 15.24,26.67 8.89,26.67 U$1.J1
  Bottom 0.406: v34.29,29.21 16.51,29.21 v15.24,27.94
N$100
  Bottom 0.406: E2.14 30.48,33.02 30.48,30.48 16.51,30.48 15.24,29.21 8.89,29.21 U$1.K2
N$101  (via drill 0.81)
  Top 0.406: E2.9 41.91,39.37 41.91,19.05 35.56,19.05 35.56,35.56 34.29,36.83 25.4,36.83 v25.4,33.02 | v16.51,33.02 8.89,33.02 U$1.L1
  Bottom 0.406: v16.51,33.02 v25.4,33.02
N$102  (via drill 0.81)
  Top 0.406: E3.18 19.05,39.37 v19.05,36.83 | v15.24,34.29 15.24,35.56 8.89,35.56 U$1.M1
  Bottom 0.406: v19.05,36.83 16.51,34.29 v15.24,34.29
N$103  (via drill 0.81)
  Top 0.406: E3.16 21.59,44.45 21.59,41.91 17.78,41.91 v17.78,38.1
  Bottom 0.406: v17.78,38.1 15.24,35.56 8.89,35.56 U$1.M2
N$104
  Top 0.406: E3.14 17.78,48.26 17.78,44.45 15.24,41.91 8.89,41.91 U$1.P1
N$105  (via drill 0.81)
  Top 0.406: E3.12 21.59,54.61 21.59,46.99 19.05,46.99 19.05,44.45 v15.24,40.64
  Bottom 0.406: v15.24,40.64 15.24,41.91 8.89,41.91 U$1.P2
N$106  (via drill 0.81)
  Top 0.406: E3.9 29.21,54.61 29.21,44.45 24.13,44.45 v24.13,45.72 | v15.24,46.99 15.24,48.26 8.89,48.26 U$1.S1
  Bottom 0.406: v24.13,45.72 22.86,46.99 v15.24,46.99
N$107
  Bottom 0.406: E3.7 26.67,49.53 16.51,49.53 15.24,48.26 8.89,48.26 U$1.S2
N$108  (via drill 0.81)
  Top 0.406: E3.3 31.75,40.64 31.75,41.91 34.29,41.91 34.29,59.69 21.59,59.69 21.59,57.15 v16.51,57.15
  Bottom 0.406: v16.51,57.15 15.24,58.42 8.89,58.42 U$1.V2
P1
  Top 0.406: SV1.30 D61.C
P2
  Bottom 0.406: D66.C 97.79,44.45 105.41,44.45 SV2.24
S1
  Top 0.406: D71.C 101.6,53.34 SV1.34
S2
  Bottom 0.406: D76.C 99.06,53.34 111.76,53.34 113.03,52.07 113.03,43.18 SV2.28
T2
  Bottom 0.406: D81.C 92.71,54.61 92.71,49.53 107.95,49.53 SV2.30
V2
  Bottom 0.406: D86.C 95.25,52.07 110.49,52.07 SV2.34
VCC  (via drill 0.81)
  Top 0.813: E3.20 24.13,31.75 24.13,7.62 21.59,5.08 E1.20 | E2.20 30.48,22.86 v30.48,35.56
  Bottom 0.813: E1.20 19.05,3.81 8.89,3.81 U$1.A2 | v30.48,35.56 27.94,33.02 26.67,34.29 21.59,34.29 E3.20

### Text on the board
Bottom: BMB/BAC CONNECTOR